# Altium project f407_oled_display.PrjPcb
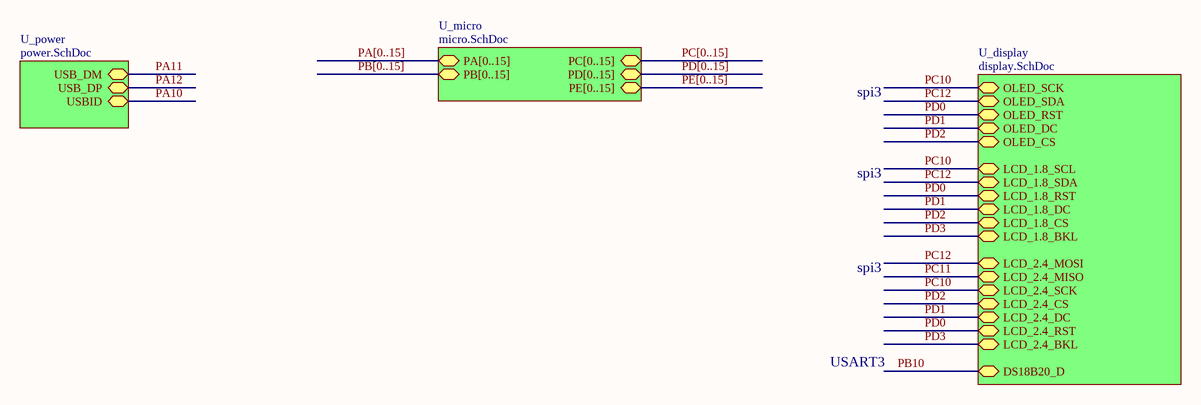
[diagram p0: top.SchDoc]
4 sheets, 62 parts. Net scope: hierarchical (ports join the sheet entries above them; power ports are global).
Board file: f407_oled_display.PcbDoc
Sheets:
  top.SchDoc
    U_display = display.SchDoc
    U_micro = micro.SchDoc
    U_power = power.SchDoc

## Sheet top.SchDoc
size A4; SheetNumber: 1; SheetTotal: 4

### Sub-sheets
U_display = display.SchDoc: OLED_SCK (bidir), OLED_SDA (bidir), OLED_RST (bidir), OLED_DC (bidir), OLED_CS (bidir), LCD_1.8_SCL (bidir), LCD_1.8_SDA (bidir), LCD_1.8_RST (bidir), LCD_1.8_DC (bidir), LCD_1.8_CS (bidir), LCD_1.8_BKL (bidir), LCD_2.4_CS (bidir), LCD_2.4_RST (bidir), LCD_2.4_DC (bidir), LCD_2.4_MOSI (bidir), LCD_2.4_SCK (bidir), LCD_2.4_BKL (bidir), LCD_2.4_MISO (bidir), DS18B20_D (bidir)
U_micro = micro.SchDoc: PA[0..15] (bidir), PB[0..15] (bidir), PC[0..15] (bidir), PD[0..15] (bidir), PE[0..15] (bidir)
U_power = power.SchDoc: USB_DM (bidir), USB_DP (bidir), USBID (bidir)

### Nets
PC10: sheet U_display/OLED_SCK, sheet U_display/LCD_1.8_SCL, sheet U_display/LCD_2.4_SCK
PC12: sheet U_display/OLED_SDA, sheet U_display/LCD_1.8_SDA, sheet U_display/LCD_2.4_MOSI
PD0: sheet U_display/OLED_RST, sheet U_display/LCD_1.8_RST, sheet U_display/LCD_2.4_RST
PD1: sheet U_display/OLED_DC, sheet U_display/LCD_1.8_DC, sheet U_display/LCD_2.4_DC
PD2: sheet U_display/OLED_CS, sheet U_display/LCD_1.8_CS, sheet U_display/LCD_2.4_CS
PD3: sheet U_display/LCD_1.8_BKL, sheet U_display/LCD_2.4_BKL

### Buses and harness runs
bus PA[0..15] = sheet U_micro/PA[0..15]
bus PB[0..15] = sheet U_micro/PB[0..15]
bus PC[0..15] = sheet U_micro/PC[0..15]
bus PD[0..15] = sheet U_micro/PD[0..15]
bus PE[0..15] = sheet U_micro/PE[0..15]

### Notes on the sheet
- spi3
- USART3

## Sheet display.SchDoc
size A4; SheetNumber: 4; SheetTotal: 4
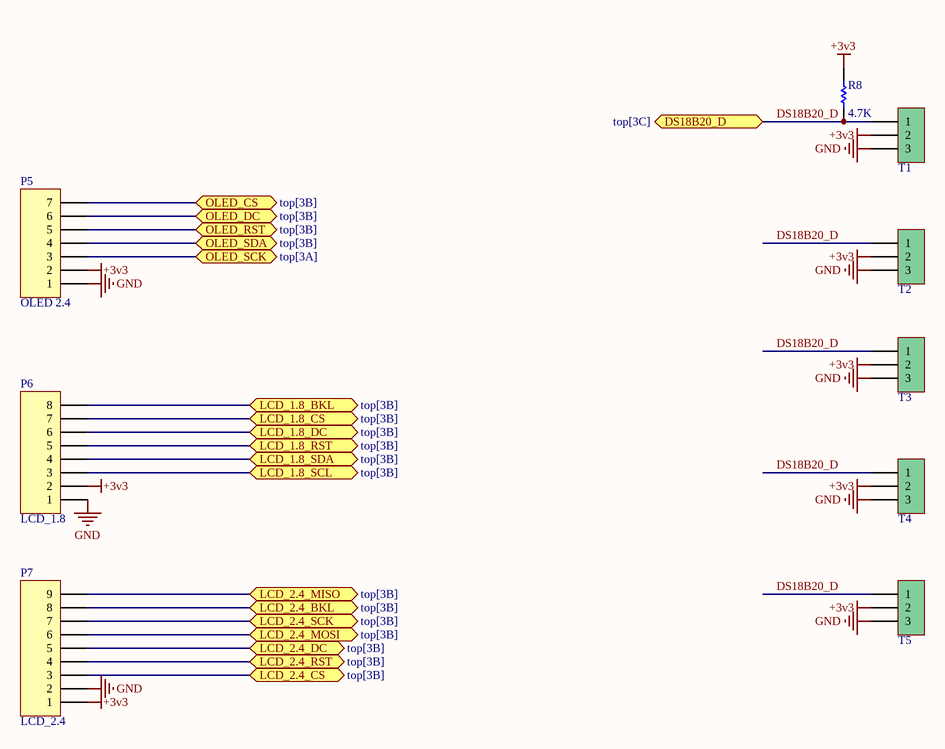
[diagram p1: display.SchDoc]

### Parts
P5  OLED 2.4  [HDR1X7]
P6  LCD_1.8  [HDR1X8]
P7  LCD_2.4  [HDR1X9]
R8  value 4.7K  [RES 0805 (2012X06L)]  (hidden comment: Res 4.7K)
T1  Phoenix terminal  [phoenix terminal 3]  (value not drawn)
T2  Phoenix terminal  [phoenix terminal 3]  (value not drawn)
T3  Phoenix terminal  [phoenix terminal 3]  (value not drawn)
T4  Phoenix terminal  [phoenix terminal 3]  (value not drawn)
T5  Phoenix terminal  [phoenix terminal 3]  (value not drawn)

### Ports
DS18B20_D (bidir, see top[3C]), LCD_1.8_BKL (bidir, see top[3B]), LCD_1.8_CS (bidir, see top[3B]), LCD_1.8_DC (bidir, see top[3B]), LCD_1.8_RST (bidir, see top[3B]), LCD_1.8_SCL (bidir, see top[3B]), LCD_1.8_SDA (bidir, see top[3B]), LCD_2.4_BKL (bidir, see top[3B]), LCD_2.4_CS (bidir, see top[3B]), LCD_2.4_DC (bidir, see top[3B]), LCD_2.4_MISO (bidir, see top[3B]), LCD_2.4_MOSI (bidir, see top[3B]), LCD_2.4_RST (bidir, see top[3B]), LCD_2.4_SCK (bidir, see top[3B]), OLED_CS (bidir, see top[3B]), OLED_DC (bidir, see top[3B]), OLED_RST (bidir, see top[3B]), OLED_SCK (bidir, see top[3A]), OLED_SDA (bidir, see top[3B])

### Nets
+3v3: P5.2 P6.2 P7.1 R8.2 T1.2 T2.2 T3.2 T4.2 T5.2
GND: P5.1 P6.1 P7.2 T1.3 T2.3 T3.3 T4.3 T5.3
DS18B20_D: R8.1 T1.1 T2.1 T3.1 T4.1 T5.1 ; port DS18B20_D
PC10: P5.3 P6.3 P7.7 ; port OLED_SCK, port LCD_1.8_SCL, port LCD_2.4_SCK
PC11: P7.9 ; port LCD_2.4_MISO
PC12: P5.4 P6.4 P7.6 ; port OLED_SDA, port LCD_1.8_SDA, port LCD_2.4_MOSI
PD0: P5.5 P6.5 P7.4 ; port OLED_RST, port LCD_1.8_RST, port LCD_2.4_RST
PD1: P5.6 P6.6 P7.5 ; port OLED_DC, port LCD_1.8_DC, port LCD_2.4_DC
PD2: P5.7 P6.7 P7.3 ; port OLED_CS, port LCD_1.8_CS, port LCD_2.4_CS
PD3: P6.8 P7.8 ; port LCD_1.8_BKL, port LCD_2.4_BKL

### Library data of the parts
P5 = Header 7: Header, 7-Pin; LatestRevisionDate: 17-Jul-2002; LatestRevisionNote: Re-released for DXP Platform.; Publisher: Altium Limited
P6 = Header 8: Header, 8-Pin; LatestRevisionDate: 17-Jul-2002; LatestRevisionNote: Re-released for DXP Platform.; Publisher: Altium Limited
P7 = Header 9: Header, 9-Pin; LatestRevisionDate: 17-Jul-2002; LatestRevisionNote: Re-released for DXP Platform.; Publisher: Altium Limited
R8 = Res1: Resistor; Published: 8-Jun-2000; LatestRevisionDate: 17-Jul-2002; LatestRevisionNote: Re-released for DXP Platform.; PackageReference: AXIAL-0.3; Publisher: Altium Limited; PackageDescription: Axial Device, Thru-Hole; 2 Leads; 0.3 in Pin Spacing
T1-T5 = Phoenix terminal 3: Terminal 3 Pin; Designer: Seyed Mohsen Ghasemain; E-mail: picpars@gmail.com; ComponentLinkURL: www.picpars.com

## Sheet micro.SchDoc
size A4; SheetNumber: 2; SheetTotal: 4
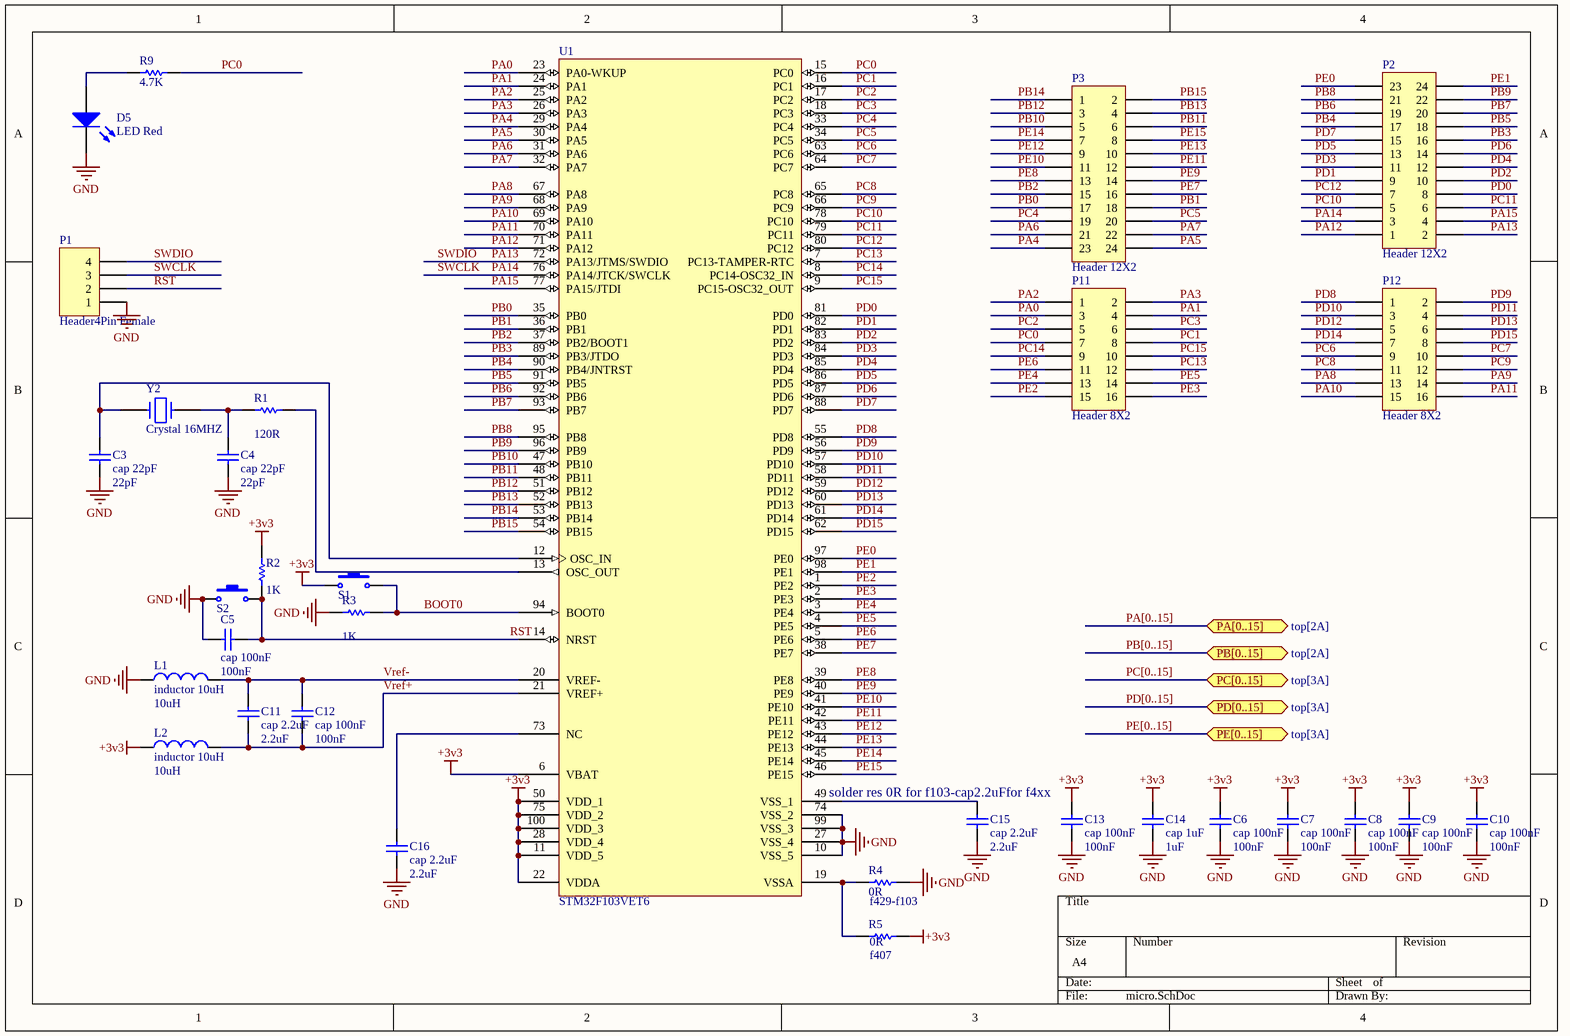
[diagram p2: micro.SchDoc]

### Parts
C3  cap 22pF  value 22pF  [Cap 805]
C4  cap 22pF  value 22pF  [Cap 805]
C5  cap 100nF  value 100nF  [Cap 805]
C6  cap 100nF  value 100nF  [Cap 805]
C7  cap 100nF  value 100nF  [Cap 805]
C8  cap 100nF  value 100nF  [Cap 805]
C9  cap 100nF  value 100nF  [Cap 805]
C10  cap 100nF  value 100nF  [Cap 805]
C11  cap 2.2uF  value 2.2uF  [Cap 805]
C12  cap 100nF  value 100nF  [Cap 805]
C13  cap 100nF  value 100nF  [Cap 805]
C14  cap 1uF  value 1uF  [Cap 805]
C15  cap 2.2uF  value 2.2uF  [Cap 805]
C16  cap 2.2uF  value 2.2uF  [Cap 805]
D5  LED Red  [0805-LED]
L1  inductor 10uH  value 10uH  [IND1206]
L2  inductor 10uH  value 10uH  [IND1206]
P1  Header4Pin Female  [HDR1X4]
P2  Header 12X2  [HDR2X12]
P3  Header 12X2  [HDR2X12]
P11  Header 8X2  [HDR2X8]
P12  Header 8X2  [HDR2X8]
R1  value 120R  [RES 0805 (2012X06L)]  (hidden comment: Res 120R)
R2  value 1K  [RES 0805 (2012X06L)]  (hidden comment: Res 1K)
R3  value 1K  [RES 0805 (2012X06L)]  (hidden comment: Res 1K)
R4  f429-f103  value 0R  [RES 0805 (2012X06L)]
R5  f407  value 0R  [RES 0805 (2012X06L)]
R9  value 4.7K  [RES 0805 (2012X06L)]  (hidden comment: Res 4.7K)
S1  Switch PB  [Switch - Push to On]  (value not drawn)
S2  Switch PB  [Switch - Push to On]  (value not drawn)
U1  STM32F103VET6  [LQFP100_N]
Y2  Crystal 16MHZ  [CRYSTAL Small]

### Ports
PA[0..15] (bidir, see top[2A]), PB[0..15] (bidir, see top[2A]), PC[0..15] (bidir, see top[3A]), PD[0..15] (bidir, see top[3A]), PE[0..15] (bidir, see top[3A])

### Nets
+3v3: C6.2 C7.2 C8.2 C9.2 C10.2 C13.2 C14.2 L2.1 R2.1 R5.2 S1.1 U1.6(VBAT) U1.11(VDD_5) U1.22(VDDA) U1.28(VDD_4) U1.50(VDD_1) U1.75(VDD_2) U1.100(VDD_3)
GND: C3.2 C4.1 C5.2 C6.1 C7.1 C8.1 C9.1 C10.1 C13.1 C14.1 C15.1 C16.1 D5.2(K) L1.1 P1.1 R3.1 R4.1 S2.1 U1.10(VSS_5) U1.27(VSS_4) U1.74(VSS_2) U1.99(VSS_3)
BOOT0: R3.2 S1.2 U1.94(BOOT0)
PA0: P11.3 U1.23(PA0-WKUP)
PA1: P11.4 U1.24(PA1)
PA2: P11.1 U1.25(PA2)
PA3: P11.2 U1.26(PA3)
PA4: P3.23 U1.29(PA4)
PA5: P3.24 U1.30(PA5)
PA6: P3.21 U1.31(PA6)
PA7: P3.22 U1.32(PA7)
PA8: P12.13 U1.67(PA8)
PA9: P12.14 U1.68(PA9)
PA10: P12.15 U1.69(PA10)
PA11: P12.16 U1.70(PA11)
PA12: P2.1 U1.71(PA12)
PA13: P1.4 P2.2 U1.72(PA13/JTMS/SWDIO)  [also labelled SWDIO]
PA14: P1.3 P2.3 U1.76(PA14/JTCK/SWCLK)  [also labelled SWCLK]
PA15: P2.4 U1.77(PA15/JTDI)
PB0: P3.17 U1.35(PB0)
PB1: P3.18 U1.36(PB1)
PB2: P3.15 U1.37(PB2/BOOT1)
PB3: P2.16 U1.89(PB3/JTDO)
PB4: P2.17 U1.90(PB4/JNTRST)
PB5: P2.18 U1.91(PB5)
PB6: P2.19 U1.92(PB6)
PB7: P2.20 U1.93(PB7)
PB8: P2.21 U1.95(PB8)
PB9: P2.22 U1.96(PB9)
PB10: P3.5 U1.47(PB10)  [project net DS18B20_D]
PB11: P3.6 U1.48(PB11)
PB12: P3.3 U1.51(PB12)
PB13: P3.4 U1.52(PB13)
PB14: P3.1 U1.53(PB14)
PB15: P3.2 U1.54(PB15)
PC0: P11.7 R9.1 U1.15(PC0)
PC1: P11.8 U1.16(PC1)
PC2: P11.5 U1.17(PC2)
PC3: P11.6 U1.18(PC3)
PC4: P3.19 U1.33(PC4)
PC5: P3.20 U1.34(PC5)
PC6: P12.9 U1.63(PC6)
PC7: P12.10 U1.64(PC7)
PC8: P12.11 U1.65(PC8)
PC9: P12.12 U1.66(PC9)
PC10: P2.5 U1.78(PC10)
PC11: P2.6 U1.79(PC11)
PC12: P2.7 U1.80(PC12)
PC13: P11.12 U1.7(PC13-TAMPER-RTC)
PC14: P11.9 U1.8(PC14-OSC32_IN)
PC15: P11.10 U1.9(PC15-OSC32_OUT)
PD0: P2.8 U1.81(PD0)
PD1: P2.9 U1.82(PD1)
PD2: P2.10 U1.83(PD2)
PD3: P2.11 U1.84(PD3)
PD4: P2.12 U1.85(PD4)
PD5: P2.13 U1.86(PD5)
PD6: P2.14 U1.87(PD6)
PD7: P2.15 U1.88(PD7)
PD8: P12.1 U1.55(PD8)
PD9: P12.2 U1.56(PD9)
PD10: P12.3 U1.57(PD10)
PD11: P12.4 U1.58(PD11)
PD12: P12.5 U1.59(PD12)
PD13: P12.6 U1.60(PD13)
PD14: P12.7 U1.61(PD14)
PD15: P12.8 U1.62(PD15)
PE0: P2.23 U1.97(PE0)
PE1: P2.24 U1.98(PE1)
PE2: P11.15 U1.1(PE2)
PE3: P11.16 U1.2(PE3)
PE4: P11.13 U1.3(PE4)
PE5: P11.14 U1.4(PE5)
PE6: P11.11 U1.5(PE6)
PE7: P3.16 U1.38(PE7)
PE8: P3.13 U1.39(PE8)
PE9: P3.14 U1.40(PE9)
PE10: P3.11 U1.41(PE10)
PE11: P3.12 U1.42(PE11)
PE12: P3.9 U1.43(PE12)
PE13: P3.10 U1.44(PE13)
PE14: P3.7 U1.45(PE14)
PE15: P3.8 U1.46(PE15)
RST: C5.1 P1.2 R2.2 S2.2 U1.14(NRST)
Vref+: C11.1 C12.1 L2.2 U1.21(VREF+)
Vref-: C11.2 C12.2 L1.2 U1.20(VREF-)
NetC3_1: C3.1 U1.12(OSC_IN) Y2.1
NetC4_2: C4.2 R1.2 Y2.2
NetC15_2: C15.2 U1.49(VSS_1)
NetC16_2: C16.2 U1.73(NC)
NetD5_1: D5.1(A) R9.2
NetR1_1: R1.1 U1.13(OSC_OUT)
NetR4_2: R4.2 R5.1 U1.19(VSSA)

### Buses and harness runs
bus PA[0..15] = port PA[0..15]
bus PB[0..15] = port PB[0..15]
bus PC[0..15] = port PC[0..15]
bus PD[0..15] = port PD[0..15]
bus PE[0..15] = port PE[0..15]

### Notes on the sheet
- solder res 0R for f103-cap2.2uFfor f4xx

### Library data of the parts
C3-C16 = Cap: Capacitor; Published: 8-Jun-2000; LatestRevisionDate: 17-Jul-2002; LatestRevisionNote: Re-released for DXP Platform.; PackageReference: RAD-0.3; Publisher: Altium Limited; PackageDescription: Radial Cap, Thru-Hole; 2 Leads; 0.3 in Pin Spacing
D5 = LED0: LED SMD; pin to pad: 1>A 2>C; Published: 8-Jun-2000; LatestRevisionDate: 08-Jul-2005; LatestRevisionNote: Mech Layer 1 removed.; PackageReference: LED-0; Publisher: Altium Limited; PackageDescription: LED; 2 Leads
L1 L2 = Inductor: Code_IEC: 1005; Published: 8-Jun-2000; LatestRevisionDate: 29-May-2009; LatestRevisionNote: IPC-7351 Footprint Added.; PackageReference: 0402-A; Publisher: Altium Limited; PackageDescription: Chip Inductor; Code_JEITA: 0402
P1 = Header 4: Header, 4-Pin; LatestRevisionDate: 17-Jul-2002; LatestRevisionNote: Re-released for DXP Platform.; Publisher: Altium Limited
P2 P3 = Header 12X2: Header, 12-Pin, Dual row; LatestRevisionDate: 17-Jul-2002; LatestRevisionNote: Re-released for DXP Platform.; Publisher: Altium Limited
P11 P12 = Header 8X2: Header, 8-Pin, Dual row; LatestRevisionDate: 17-Jul-2002; LatestRevisionNote: Re-released for DXP Platform.; Publisher: Altium Limited
R1-R5 R9 = Res1: Resistor; Published: 8-Jun-2000; LatestRevisionDate: 17-Jul-2002; LatestRevisionNote: Re-released for DXP Platform.; PackageReference: AXIAL-0.3; Publisher: Altium Limited; PackageDescription: Axial Device, Thru-Hole; 2 Leads; 0.3 in Pin Spacing
S1 S2 = Switch PB: Push Button Switch
U1 = STM32F103V8T6: STM32 ARM-based 32-bit MCU with 64 Kbytes Flash, 100-pin LQFP, Industrial Temperature; Published: 30-May-2008; DatasheetVersion: rev6, Mar-2008; PackageVersion: Mar-2008; PackageReference: LQFP100; Publisher: Altium Limited; PackageDescription: 100-Pin Low-Profile Quad Flat Pack, 14 x 14 mm Body, 0.5 mm Pitch (LQFP100); ComponentLink1Description: Manufacturer Link; ComponentLink1URL: www.st.com/stm32; ComponentLink2Description: Datasheet; ComponentLink2URL: http://www.st.com/stonline/products/literature/ds/13587.pdf
Y2 = CRYSTAL

## Sheet power.SchDoc
size A4; SheetNumber: 3; SheetTotal: 4
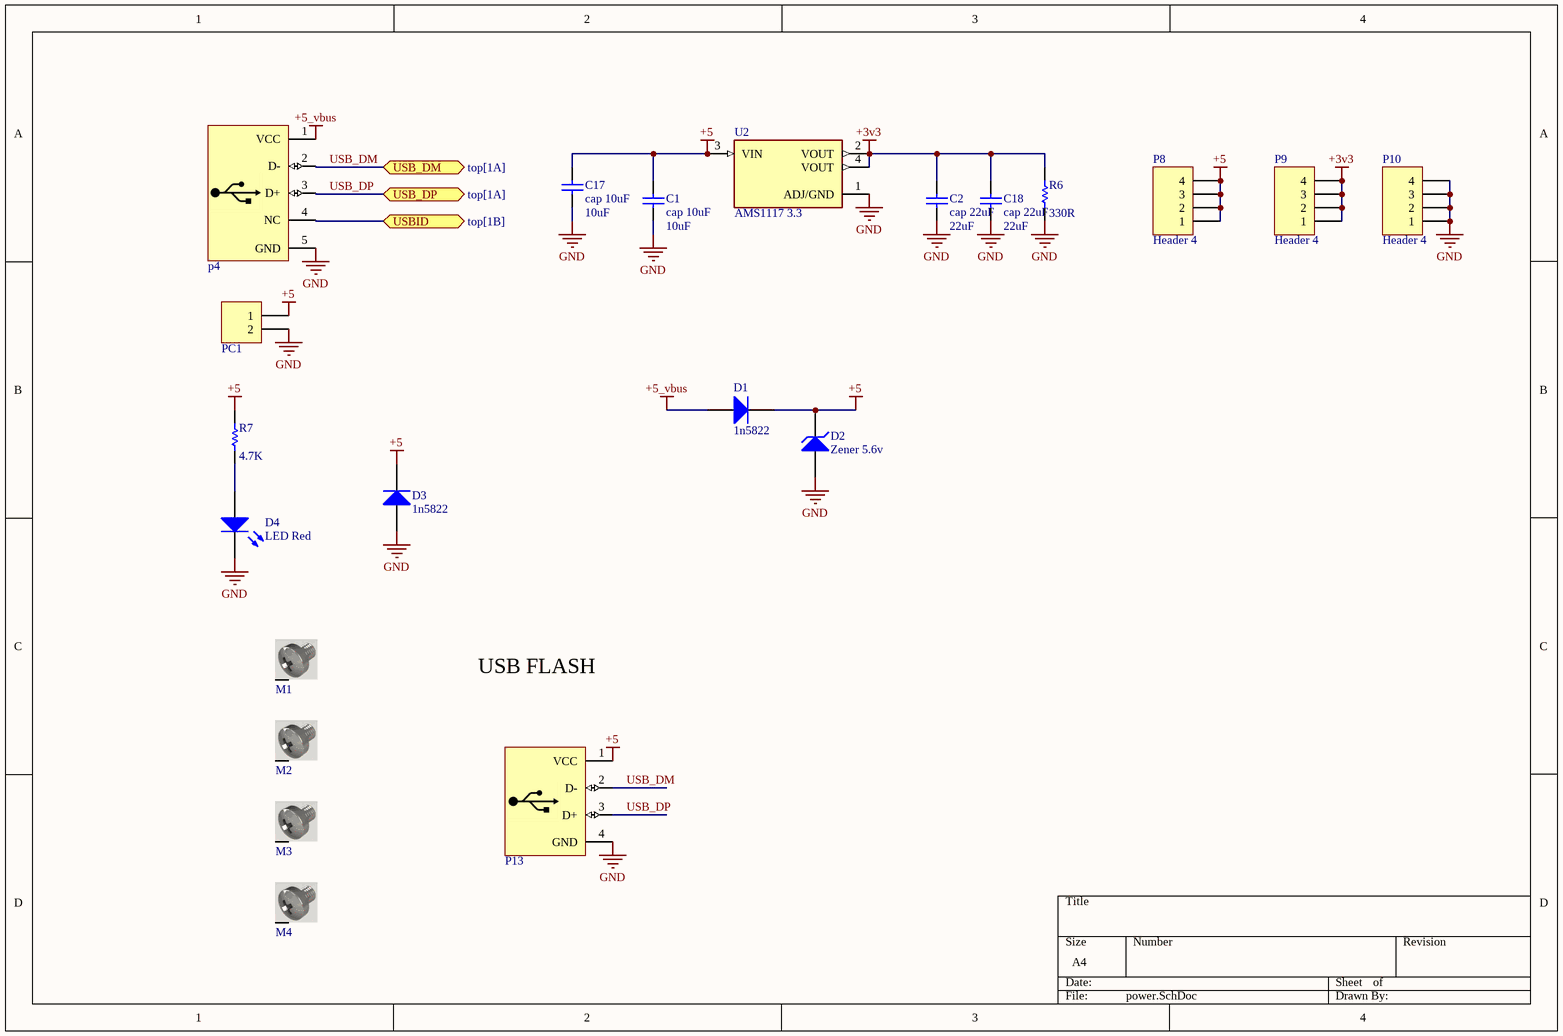
[diagram p3: power.SchDoc]

### Parts
C1  cap 10uF  value 10uF  [Cap 805]
C2  cap 22uF  value 22uF  [Cap 805]
C17  cap 10uF  value 10uF  [Cap 805]
C18  cap 22uF  value 22uF  [Cap 805]
D1  1n5822  [SMA DIODE 2]
D2  Zener 5.6v  [Diode 1n4148 SMD]
D3  1n5822  [SMA DIODE 2]
D4  LED Red  [0805-LED]
M1  Spacer-ff 10mm  [Screw]  (value not drawn)
M2  Spacer-ff 10mm  [screw]  (value not drawn)
M3  Spacer-ff 10mm  [screw]  (value not drawn)
M4  Spacer-ff 10mm  [screw]  (value not drawn)
p4  USB Connector  [USB_AB_BM_SHS]  (value not drawn)
P8  Header 4  [HDR1X4]
P9  Header 4  [HDR1X4]
P10  Header 4  [HDR1X4]
P13  USB Connector A Type Femal  [USB2.5-2H4C]  (value not drawn)
PC1  Power Connector  [My_ Power_Connector]  (value not drawn)
R6  value 330R  [RES 0805 (2012X06L)]  (hidden comment: Res 330R)
R7  value 4.7K  [RES 0805 (2012X06L)]  (hidden comment: Res 4.7K)
U2  AMS1117 3.3  [SOT223]

### Ports
USB_DM (bidir, see top[1A]), USB_DP (bidir, see top[1A]), USBID (bidir, see top[1B])

### Nets
+3v3: C2.2 C18.2 P9.1 P9.2 P9.3 P9.4 R6.2 U2.2(VOUT) U2.4(VOUT)
+5: C1.2 C17.2 D1.2(K) D2.2(K) D3.2(K) P8.1 P8.2 P8.3 P8.4 P13.1(VCC) PC1.1 R7.2 U2.3(VIN)
+5_vbus: D1.1(A) p4.1(VCC)
GND: C1.1 C2.1 C17.1 C18.1 D2.1(A) D3.1(A) D4.2(K) p4.5(GND) P10.1 P10.2 P10.3 P10.4 P13.4(GND) PC1.2 R6.1 U2.1(ADJ/GND)
PA10: p4.4(NC) ; port USBID
USB_DM: p4.2(D-) P13.2(D-) ; port USB_DM  [project net PA11]
USB_DP: p4.3(D+) P13.3(D+) ; port USB_DP  [project net PA12]
NetD4_1: D4.1(A) R7.1

Not connected (* = marked no-connect by the designer): M1 S; M2 S; M3 S; M4 S

### Notes on the sheet
- USB FLASH

### Library data of the parts
C1 C2 C17 C18 = Cap: Capacitor; Published: 8-Jun-2000; LatestRevisionDate: 17-Jul-2002; LatestRevisionNote: Re-released for DXP Platform.; PackageReference: RAD-0.3; Publisher: Altium Limited; PackageDescription: Radial Cap, Thru-Hole; 2 Leads; 0.3 in Pin Spacing
D1 D3 = Diode 1N4007: 1 Amp schottky Diode; Published: 8-Jun-2000; LatestRevisionDate: 17-Jul-2002; LatestRevisionNote: Re-released for DXP Platform.; DatasheetVersion: 1998; PackageVersion: Aug-1999; PackageReference: DO-41; Publisher: Altium Limited; PackageDescription: Diode, Axial; Body 5.2 x 2.7 mm (LxDia. max), Lead Dia. 0.86 mm (max); Code_JEDEC: DO-204-AL; ComponentLink1Description: Manufacturer Link; ComponentLink1URL: http://www.fairchildsemi.com/; ComponentLink2Description: Datasheet; ComponentLink2URL: http://www.fairchildsemi.com/ds/1N%2F1N4001.pdf
D2 = D Zener: Zener Diode; Published: 8-Jun-2000; LatestRevisionDate: 17-Jul-2002; LatestRevisionNote: Re-released for DXP Platform.; PackageReference: DIODE-0.7; Publisher: Altium Limited; PackageDescription: Diode, Thru-Hole; 2 Leads; 0.7 in Pin Spacing
D4 = LED0: LED SMD; pin to pad: 1>A 2>C; Published: 8-Jun-2000; LatestRevisionDate: 08-Jul-2005; LatestRevisionNote: Mech Layer 1 removed.; PackageReference: LED-0; Publisher: Altium Limited; PackageDescription: LED; 2 Leads
M1-M4 = Board Screw: Board Screw With Spacer
p4 = USB MICRO: USB Connector MICRO-B Type; Designer: ABBAS BASEREH; Max Current: 1600mA; Mounting Technology: Surface Mount\Through-Hole; Category: Connector; Pin Count: 5-7; Publisher: ABBAS BASEREH; Status: Unreleased; ComponentLink1Description: Datasheet; ComponentLink2Description: Reference; Update: 1395-11-17
P8-P10 = Header 4: Header, 4-Pin; LatestRevisionDate: 17-Jul-2002; LatestRevisionNote: Re-released for DXP Platform.; Publisher: Altium Limited
P13 = USB A-Type: USB Connector-A Type Femal
PC1 = Power Connector: white Power Connector
R6 R7 = Res1: Resistor; Published: 8-Jun-2000; LatestRevisionDate: 17-Jul-2002; LatestRevisionNote: Re-released for DXP Platform.; PackageReference: AXIAL-0.3; Publisher: Altium Limited; PackageDescription: Axial Device, Thru-Hole; 2 Leads; 0.3 in Pin Spacing
U2 = AMS1117: MF: Seeed Technology; Availability: Unavailable; SnapEDA_Link: https://www.snapeda.com/parts/AMS1117/Seeed%20Technology%20Co.%2C%20Ltd/view-part/184428/?ref=snap; MP: AMS1117; Price: None; Value: *; Package: SOT-223 Seeed Technology

## Nets that join several sheets
+3v3: display (9 pins), micro (18 pins), power (9 pins)
GND: display (8 pins), micro (22 pins), power (16 pins)
DS18B20_D: display (6 pins), micro (P3.5 U1.47)
PA10: micro (P12.15 U1.69), power (p4.4)
PA11: micro (P12.16 U1.70), power (p4.2 P13.2)
PA12: micro (P2.1 U1.71), power (p4.3 P13.3)
PC10: display (P5.3 P6.3 P7.7), micro (P2.5 U1.78)
PC11: display (P7.9), micro (P2.6 U1.79)
PC12: display (P5.4 P6.4 P7.6), micro (P2.7 U1.80)
PD0: display (P5.5 P6.5 P7.4), micro (P2.8 U1.81)
PD1: display (P5.6 P6.6 P7.5), micro (P2.9 U1.82)
PD2: display (P5.7 P6.7 P7.3), micro (P2.10 U1.83)
PD3: display (P6.8 P7.8), micro (P2.11 U1.84)